# Altium schematic sheet ACPowerDistributionUSB-PD.SchDoc
size A3; SheetNumber: 4; SheetTotal: 5
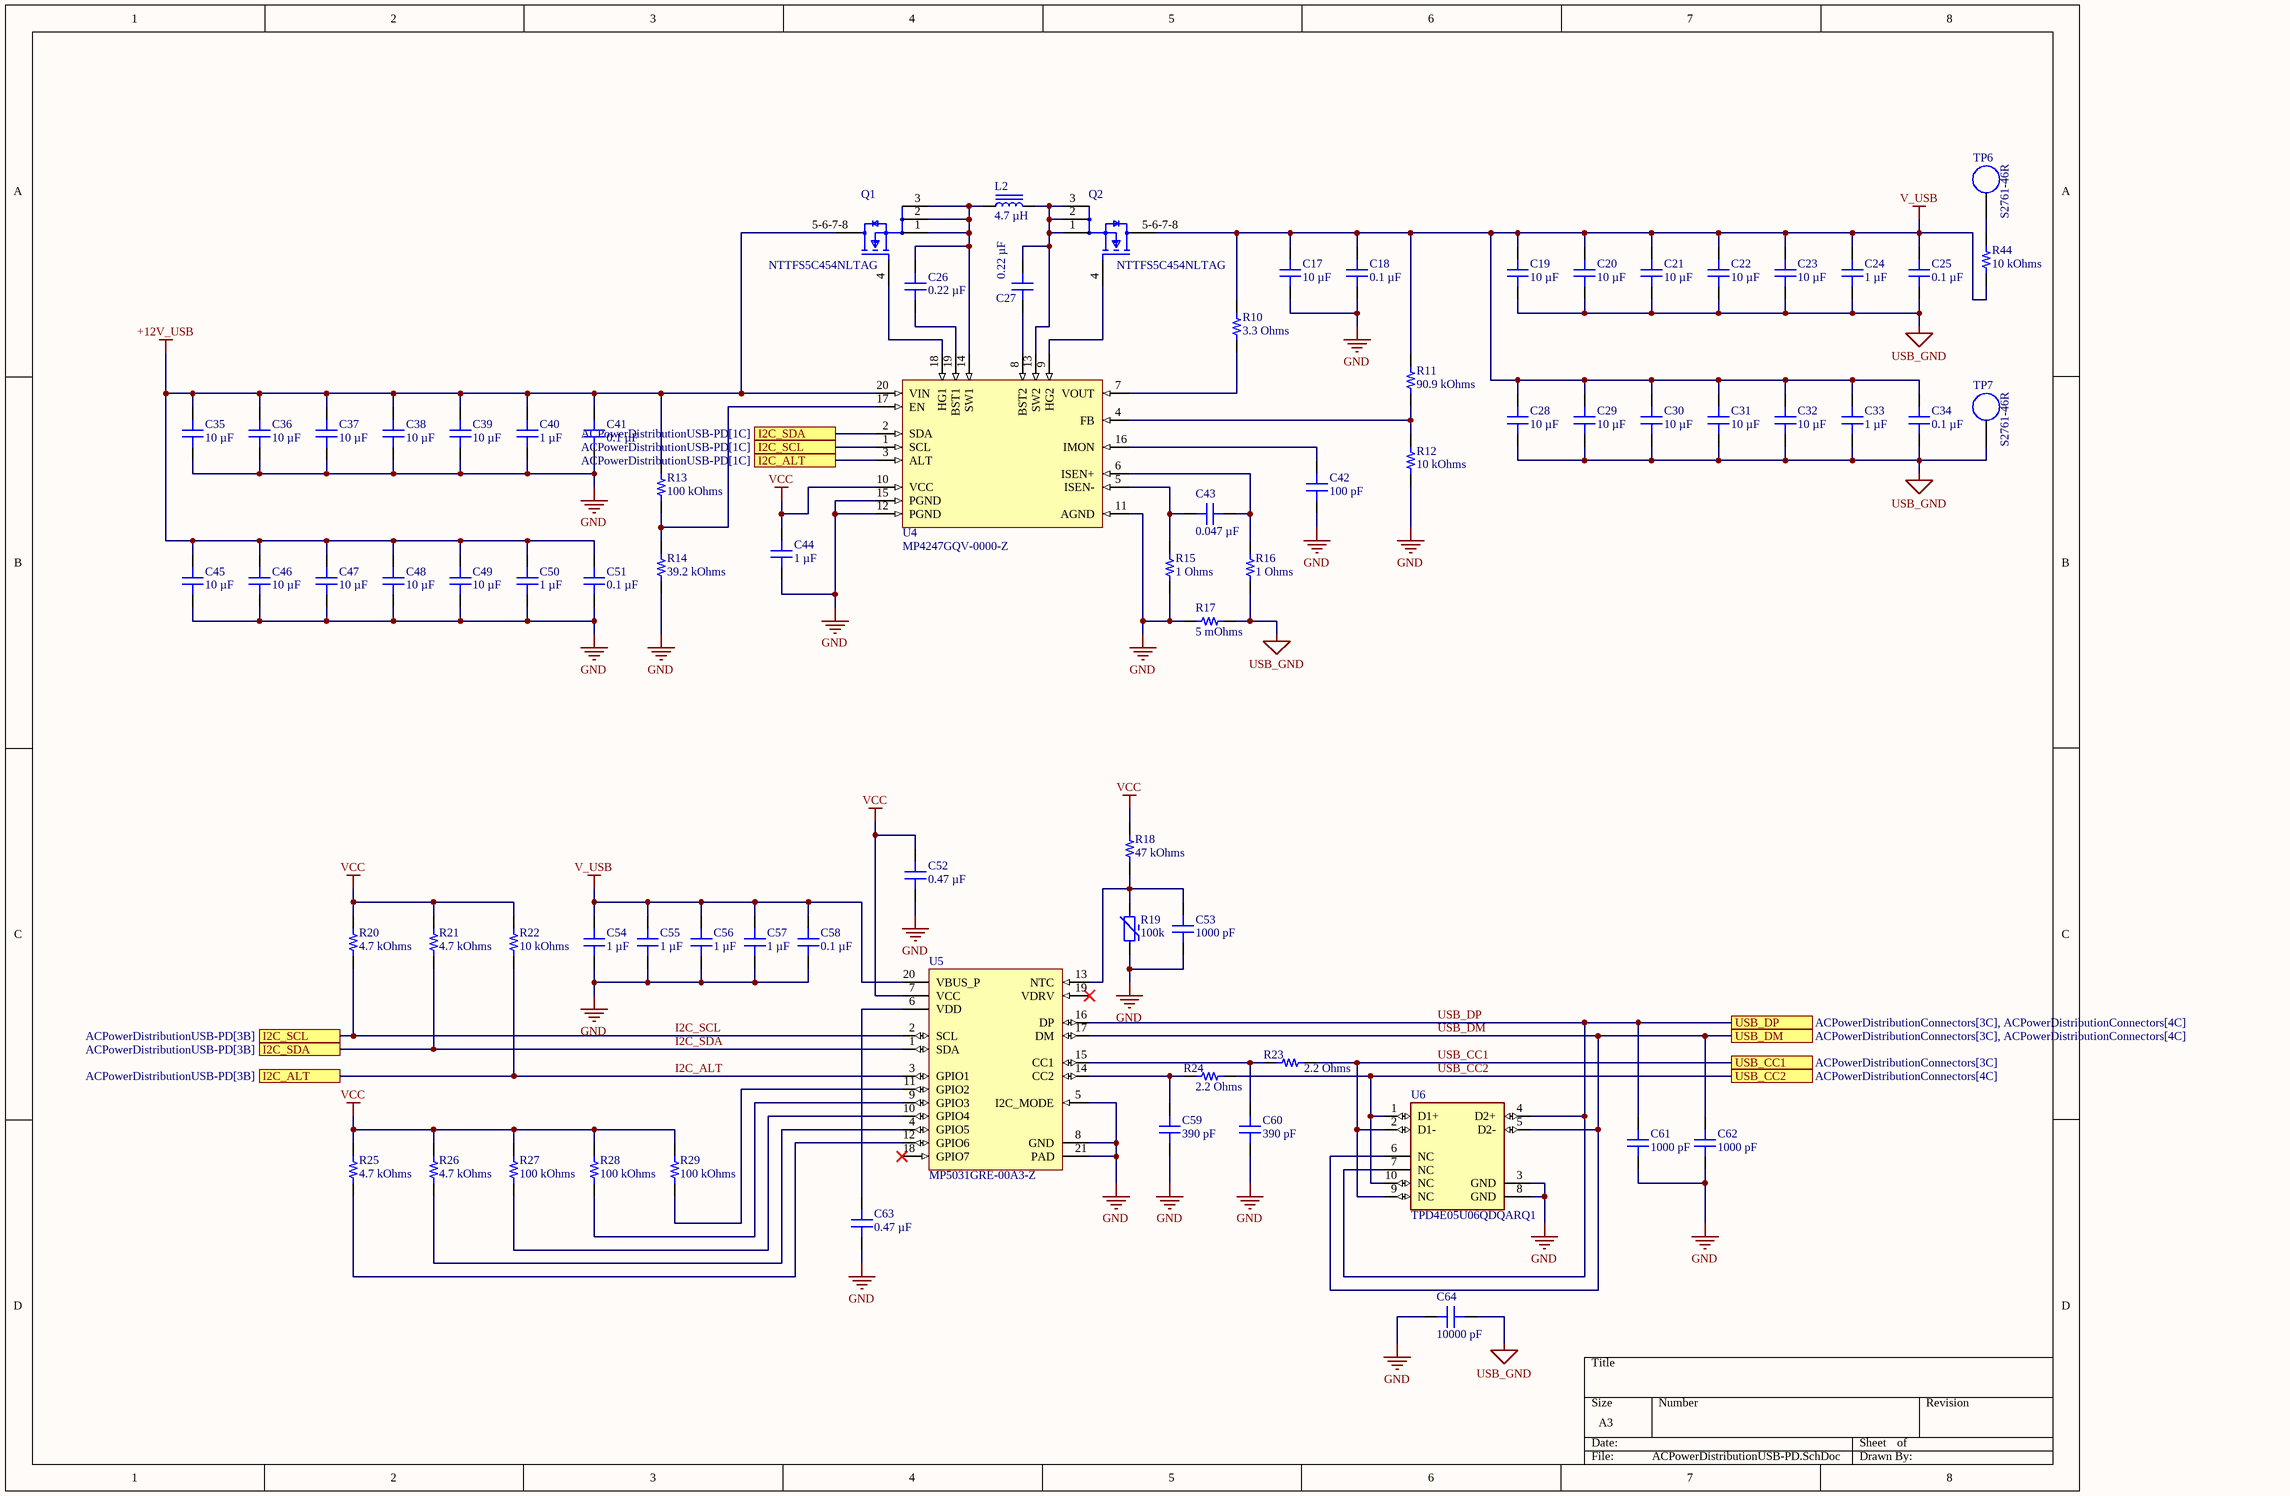
[diagram p0: ACPowerDistributionUSB-PD.SchDoc]

## Parts
C17  10 µF  [CAP 1210_3225 - 1MM]
C18  0.1 µF  [CAP 0603_1608]
C19  10 µF  [CAP 1210_3225 - 1MM]
C20  10 µF  [CAP 1210_3225 - 1MM]
C21  10 µF  [CAP 1210_3225 - 1MM]
C22  10 µF  [CAP 1210_3225 - 1MM]
C23  10 µF  [CAP 1210_3225 - 1MM]
C24  1 µF  [CAP 0603_1608]
C25  0.1 µF  [CAP 0603_1608]
C26  0.22 µF  [MURATA GRM188 0603_1608]
C27  0.22 µF  [MURATA GRM188 0603_1608]
C28  10 µF  [CAP 1210_3225 - 1MM]
C29  10 µF  [CAP 1210_3225 - 1MM]
C30  10 µF  [CAP 1210_3225 - 1MM]
C31  10 µF  [CAP 1210_3225 - 1MM]
C32  10 µF  [CAP 1210_3225 - 1MM]
C33  1 µF  [CAP 0603_1608]
C34  0.1 µF  [CAP 0603_1608]
C35  10 µF  [CAP 1210_3225 - 1MM]
C36  10 µF  [CAP 1210_3225 - 1MM]
C37  10 µF  [CAP 1210_3225 - 1MM]
C38  10 µF  [CAP 1210_3225 - 1MM]
C39  10 µF  [CAP 1210_3225 - 1MM]
C40  1 µF  [CAP 0603_1608]
C41  0.1 µF  [CAP 0603_1608]
C42  100 pF  [CAP 0603_1608]
C43  0.047 µF  [CAP 0603_1608]
C44  1 µF  [CAP 0603_1608]
C45  10 µF  [CAP 1210_3225 - 1MM]
C46  10 µF  [CAP 1210_3225 - 1MM]
C47  10 µF  [CAP 1210_3225 - 1MM]
C48  10 µF  [CAP 1210_3225 - 1MM]
C49  10 µF  [CAP 1210_3225 - 1MM]
C50  1 µF  [CAP 0603_1608]
C51  0.1 µF  [CAP 0603_1608]
C52  0.47 µF  [CAP 0603_1608]
C53  1000 pF  [CAP 0603_1608]
C54  1 µF  [CAP 0603_1608]
C55  1 µF  [CAP 0603_1608]
C56  1 µF  [CAP 0603_1608]
C57  1 µF  [CAP 0603_1608]
C58  0.1 µF  [CAP 0603_1608]
C59  390 pF  [CAP 0603_1608]
C60  390 pF  [CAP 0603_1608]
C61  1000 pF  [CAP 0603_1608]
C62  1000 pF  [CAP 0603_1608]
C63  0.47 µF  [CAP 0603_1608]
C64  10000 pF  [CAP 0603_1608]
L2  4.7 µH  [WURTH WE-HCI 7040]
Q1  NTTFS5C454NLTAG  [FP-511AB-MFG]
Q2  NTTFS5C454NLTAG  [FP-511AB-MFG]
R10  3.3 Ohms  [RES 0603_1608]
R11  90.9 kOhms  [RES 0603_1608]
R12  10 kOhms  [RES 0603_1608]
R13  100 kOhms  [RES 0603_1608]
R14  39.2 kOhms  [RES 0603_1608]
R15  1 Ohms  [RES 0603_1608]
R16  1 Ohms  [RES 0603_1608]
R17  5 mOhms  [STACKPOLE CSR1206]
R18  47 kOhms  [RES 0603_1608]
R19  100k  [NTC 0603_1608]
R20  4.7 kOhms  [RES 0603_1608]
R21  4.7 kOhms  [RES 0603_1608]
R22  10 kOhms  [RES 0603_1608]
R23  2.2 Ohms  [RES 0603_1608]
R24  2.2 Ohms  [RES 0603_1608]
R25  4.7 kOhms  [RES 0603_1608]
R26  4.7 kOhms  [RES 0603_1608]
R27  100 kOhms  [RES 0603_1608]
R28  100 kOhms  [RES 0603_1608]
R29  100 kOhms  [RES 0603_1608]
R44  10 kOhms  [RES 0603_1608]
TP6  S2761-46R  [S2761-46R]
TP7  S2761-46R  [S2761-46R]
U4  MP4247GQV-0000-Z  [MP4247GQV]
U5  MP5031GRE-00A3-Z  [MP5031GRE]
U6  TPD4E05U06QDQARQ1  [FP-DQA0010A-MFG]

## Ports
I2C_ALT (see ACPowerDistributionUSB-PD[1C]), I2C_ALT (see ACPowerDistributionUSB-PD[3B]), I2C_SCL (see ACPowerDistributionUSB-PD[1C]), I2C_SCL (see ACPowerDistributionUSB-PD[3B]), I2C_SDA (see ACPowerDistributionUSB-PD[1C]), I2C_SDA (see ACPowerDistributionUSB-PD[3B]), USB_CC1 (see ACPowerDistributionConnectors[3C]), USB_CC2 (see ACPowerDistributionConnectors[4C]), USB_DM (see ACPowerDistributionConnectors[3C], ACPowerDistributionConnectors[4C]), USB_DP (see ACPowerDistributionConnectors[3C], ACPowerDistributionConnectors[4C])

## Nets
+12V_USB: C35.2 C36.2 C37.2 C38.2 C39.2 C40.2 C41.2 C45.2 C46.2 C47.2 C48.2 C49.2 C50.2 C51.2 Q1.5-6-7-8(D) R13.2 U4.20(VIN)
GND: C17.1 C18.1 C35.1 C36.1 C37.1 C38.1 C39.1 C40.1 C41.1 C42.1 C44.1 C45.1 C46.1 C47.1 C48.1 C49.1 C50.1 C51.1 C52.1 C53.1 C54.1 C55.1 C56.1 C57.1 C58.1 C59.1 C60.1 C61.1 C62.1 C63.1 C64.1 R12.1 R14.1 R15.1 R17.1 R19.1 U4.11(AGND) U4.12(PGND) U4.15(PGND) U5.5(I2C_MODE) U5.8(GND) U5.21(PAD) U6.3(GND) U6.8(GND)
USB_GND: C19.1 C20.1 C21.1 C22.1 C23.1 C24.1 C25.1 C28.1 C29.1 C30.1 C31.1 C32.1 C33.1 C34.1 C64.2 R16.1 R17.2 TP7.1
V_USB: C17.2 C18.2 C19.2 C20.2 C21.2 C22.2 C23.2 C24.2 C25.2 C28.2 C29.2 C30.2 C31.2 C32.2 C33.2 C34.2 C54.2 C55.2 C56.2 C57.2 C58.2 Q2.5-6-7-8(D) R10.2 R11.2 R44.1 U5.20(VBUS_P)
VCC: C44.2 C52.2 R18.2 R20.2 R21.2 R22.2 R25.2 R26.2 R27.2 R28.2 R29.2 U4.10(VCC) U5.7(VCC)
I2C_ALT: R22.1 U4.3(ALT) U5.3(GPIO1) ; port I2C_ALT
I2C_SCL: R20.1 U4.1(SCL) U5.2(SCL) ; port I2C_SCL
I2C_SDA: R21.1 U4.2(SDA) U5.1(SDA) ; port I2C_SDA
USB_CC1: R23.2 U6.2(D1-) U6.9(NC) ; port USB_CC1
USB_CC2: R24.2 U6.1(D1+) U6.10(NC) ; port USB_CC2
USB_DM: C62.2 U5.17(DM) U6.5(D2-) U6.6(NC) ; port USB_DM
USB_DP: C61.2 U5.16(DP) U6.4(D2+) U6.7(NC) ; port USB_DP
NetC26_1: C26.1 U4.19(BST1)
NetC26_2: C26.2 L2.1 Q1.1(S) Q1.2(S) Q1.3(S) U4.14(SW1)
NetC27_1: C27.1 U4.8(BST2)
NetC27_2: C27.2 L2.2 Q2.1(S) Q2.2(S) Q2.3(S) U4.13(SW2)
NetC42_2: C42.2 U4.16(IMON)
NetC43_1: C43.1 R15.2 U4.5(ISEN-)
NetC43_2: C43.2 R16.2 U4.6(ISEN+)
NetC53_2: C53.2 R18.1 R19.2 U5.13(NTC)
NetC59_2: C59.2 R24.1 U5.14(CC2)
NetC60_2: C60.2 R23.1 U5.15(CC1)
NetC63_2: C63.2 U5.6(VDD)
NetQ1_4: Q1.4(G) U4.18(HG1)
NetQ2_4: Q2.4(G) U4.9(HG2)
NetR10_1: R10.1 U4.7(VOUT)
NetR11_1: R11.1 R12.2 U4.4(FB)
NetR13_1: R13.1 R14.2 U4.17(EN)
NetR25_1: R25.1 U5.12(GPIO6)
NetR26_1: R26.1 U5.4(GPIO5)
NetR27_1: R27.1 U5.10(GPIO4)
NetR28_1: R28.1 U5.9(GPIO3)
NetR29_1: R29.1 U5.11(GPIO2)
NetR44_2: R44.2 TP6.1

Not connected (* = marked no-connect by the designer): U5 18(GPIO7)* 19(VDRV)*

## Library data of the parts
C17 C19-C23 C28-C32 C35-C39 C45-C49 = GCM32EC71H106KA03L: CAP CER 10UF 50V X7S 1210; manufacturer: Murata Electronics; Tolerance: ±10%; Part Number: GCM32EC71H106KA03L; Value: 10 µF; Applications: Automotive; Capacitance: 10 µF; componentlink1description: Datasheet; componentlink1url: https://search.murata.co.jp/Ceramy/image/img/A01X/G101/ENG/GCM32EC71H106KA03-01.pdf; componentlink2description: DigiKey Link; componentlink2url: https://www.digikey.com/en/products/detail/murata-electronics/GCM32EC71H106KA03L/4903991; Device Package: 1210 (3225 Metric); lastupdated: 6/4/2024 7:21:03 PM; Lifecycle Status: Active; Minimum Order: 1; Mounting Type: Surface Mount, MLCC; Operating Temperature: -55°C ~ 125°C; Package / Case: 1210 (3225 Metric); packaging: TapeAndReel; partid: 23812; Part Status: Active; price: 0.25; Ratings: AEC-Q200; series: GCM; Size / Dimension: 0.126" L x 0.098" W (3.20mm x 2.50mm); Supplier 1: DigiKey; Supplier Part Number 1: 490-14536-1-ND; Temperature Coefficient: X7S; Thickness (Max): 0.106" (2.70mm); Voltage - Rated: 50V
C18 C25 C34 C41 C51 C58 = CL10B104KA8WPNC: CAP CER 0.1UF 25V X7R 0603; manufacturer: Samsung Electro-Mechanics; Tolerance: ±10%; Part Number: CL10B104KA8WPNC; Capacitance: 0.1 µF; Applications: Automotive; componentlink1description: Datasheet; componentlink1url: http://www.samsungsem.com/kr/support/product-search/mlcc/CL10B104KA8WPNC.jsp; componentlink2description: DigiKey Link; componentlink2url: https://www.digikey.com/en/products/detail/samsung-electro-mechanics/CL10B104KA8WPNC/5961201; Device Package: 0603 (1608 Metric); Features: Open Mode; lastupdated: 2/9/2024 8:10:26 PM; Lifecycle Status: Active; Minimum Order: 1; Mounting Type: Surface Mount, MLCC; Operating Temperature: -55°C ~ 125°C; Package / Case: 0603 (1608 Metric); packaging: TapeAndReel; partid: 5631; Part Status: Active; price: 0.01; Ratings: AEC-Q200; series: CL; Size / Dimension: 0.063" L x 0.031" W (1.60mm x 0.80mm); Supplier 1: DigiKey; Supplier Part Number 1: 1276-6717-1-ND; Temperature Coefficient: X7R; Thickness (Max): 0.035" (0.90mm); value: 0.1 µF; Voltage - Rated: 25V
C24 C33 C40 C44 C50 C54-C57 = CL10A105KA8NNNC: CAP CER 1UF 25V X5R 0603; manufacturer: Samsung Electro-Mechanics; Tolerance: ±10%; Part Number: CL10A105KA8NNNC; Capacitance: 1 µF; Applications: General Purpose; componentlink1description: Datasheet; componentlink1url: http://www.samsungsem.com/kr/support/product-search/mlcc/CL10A105KA8NNNC.jsp; componentlink2description: DigiKey Link; componentlink2url: https://www.digikey.com/en/products/detail/samsung-electro-mechanics/CL10A105KA8NNNC/3886760; Device Package: 0603 (1608 Metric); lastupdated: 2/9/2024 8:10:26 PM; Lifecycle Status: Active; Minimum Order: 1; Mounting Type: Surface Mount, MLCC; Operating Temperature: -55°C ~ 85°C; Package / Case: 0603 (1608 Metric); packaging: TapeAndReel; partid: 5508; Part Status: Active; price: 0.01; series: CL; Size / Dimension: 0.063" L x 0.031" W (1.60mm x 0.80mm); Supplier 1: DigiKey; Supplier Part Number 1: 1276-1102-1-ND; Temperature Coefficient: X5R; Thickness (Max): 0.035" (0.90mm); value: 1 µF; Voltage - Rated: 25V
C26 C27 = GRM188R71H224KAC4D: CAP CER 0.22UF 50V X7R 0603; manufacturer: Murata Electronics; Tolerance: ±10%; Part Number: GRM188R71H224KAC4D; Capacitance: 0.22 µF; Applications: General Purpose; componentlink1description: Datasheet; componentlink1url: https://search.murata.co.jp/Ceramy/image/img/A01X/G101/ENG/GRM188R71H224KAC4-01.pdf; componentlink2description: DigiKey Link; componentlink2url: https://www.digikey.com/en/products/detail/murata-electronics/GRM188R71H224KAC4D/5797498; Device Package: 0603 (1608 Metric); lastupdated: 7/20/2024 12:23:21 AM; Lifecycle Status: Active; Minimum Order: 1; Mounting Type: Surface Mount, MLCC; Operating Temperature: -55°C ~ 125°C; Package / Case: 0603 (1608 Metric); packaging: TapeAndReel; partid: 8415; Part Status: Active; price: 0.02; series: GRM; Size / Dimension: 0.063" L x 0.031" W (1.60mm x 0.80mm); Supplier 1: DigiKey; Supplier Part Number 1: 490-12546-1-ND; Temperature Coefficient: X7R; Thickness (Max): 0.035" (0.90mm); value: 0.22 µF; Voltage - Rated: 50V
C42 = CC0603JRNPO8BN101: CAP CER 100PF 25V C0G/NPO 0603; manufacturer: Yageo; Temperature Coefficient: C0G, NP0; Tolerance: ±5%; Part Number: CC0603JRNPO8BN101; Capacitance: 100 pF; Applications: General Purpose; componentlink1description: Datasheet; componentlink1url: https://www.yageo.com/upload/media/product/productsearch/datasheet/mlcc/UPY-GP_NP0_16V-to-50V_17.pdf; componentlink2description: DigiKey Link; componentlink2url: https://www.digikey.com/en/products/detail/yageo/CC0603JRNPO8BN101/5883587; Device Package: 0603 (1608 Metric); lastupdated: 2/9/2024 8:10:21 PM; Lifecycle Status: Active; Minimum Order: 1; Mounting Type: Surface Mount, MLCC; Operating Temperature: -55°C ~ 125°C; Package / Case: 0603 (1608 Metric); packaging: TapeAndReel; partid: 9439; Part Status: Active; price: 0.01; series: CC; Size / Dimension: 0.063" L x 0.031" W (1.60mm x 0.80mm); Supplier 1: DigiKey; Supplier Part Number 1: 311-3949-1-ND; Thickness (Max): 0.035" (0.90mm); value: 100 pF; Voltage - Rated: 25V
C43 = CL10B473KB8NNNC: CAP CER 0.047UF 50V X7R 0603; manufacturer: Samsung Electro-Mechanics; Tolerance: ±10%; Part Number: CL10B473KB8NNNC; Capacitance: 0.047 µF; Applications: General Purpose; componentlink1description: Datasheet; componentlink1url: http://www.samsungsem.com/kr/support/product-search/mlcc/CL10B473KB8NNNC.jsp; componentlink2description: DigiKey Link; componentlink2url: https://www.digikey.com/en/products/detail/samsung-electro-mechanics/CL10B473KB8NNNC/3886721; Device Package: 0603 (1608 Metric); lastupdated: 2/9/2024 8:10:20 PM; Lifecycle Status: Active; Minimum Order: 1; Mounting Type: Surface Mount, MLCC; Operating Temperature: -55°C ~ 125°C; Package / Case: 0603 (1608 Metric); packaging: TapeAndReel; partid: 9888; Part Status: Active; price: 0.01; series: CL; Size / Dimension: 0.063" L x 0.031" W (1.60mm x 0.80mm); Supplier 1: DigiKey; Supplier Part Number 1: 1276-1063-1-ND; Temperature Coefficient: X7R; Thickness (Max): 0.035" (0.90mm); value: 0.047 µF; Voltage - Rated: 50V
C52 C63 = CC0603KRX5R8BB474: CAP CER 0.47UF 25V X5R 0603; manufacturer: Yageo; Tolerance: ±10%; Part Number: CC0603KRX5R8BB474; Capacitance: 0.47 µF; Applications: General Purpose; componentlink1description: Datasheet; componentlink1url: https://www.yageo.com/upload/media/product/productsearch/datasheet/mlcc/UPY-GPHC_X5R_4V-to-50V_25.pdf; componentlink2description: DigiKey Link; componentlink2url: https://www.digikey.com/en/products/detail/yageo/CC0603KRX5R8BB474/5883728; Device Package: 0603 (1608 Metric); lastupdated: 2/9/2024 8:10:30 PM; Lifecycle Status: Active; Minimum Order: 1; Mounting Type: Surface Mount, MLCC; Operating Temperature: -55°C ~ 85°C; Package / Case: 0603 (1608 Metric); packaging: TapeAndReel; partid: 2276; Part Status: Active; price: 0.01; series: CC; Size / Dimension: 0.063" L x 0.031" W (1.60mm x 0.80mm); Supplier 1: DigiKey; Supplier Part Number 1: 311-3365-1-ND; Temperature Coefficient: X5R; Thickness (Max): 0.035" (0.90mm); value: 0.47 µF; Voltage - Rated: 25V
C53 = CC0603JRNPO7BN102: CAP CER 1000PF 16V C0G/NPO 0603; manufacturer: Yageo; Temperature Coefficient: C0G, NP0; Tolerance: ±5%; Part Number: CC0603JRNPO7BN102; Capacitance: 1000 pF; Applications: General Purpose; componentlink1description: Datasheet; componentlink1url: https://www.yageo.com/upload/media/product/productsearch/datasheet/mlcc/UPY-GP_NP0_16V-to-50V_17.pdf; componentlink2description: DigiKey Link; componentlink2url: https://www.digikey.com/en/products/detail/yageo/CC0603JRNPO7BN102/5883578; Device Package: 0603 (1608 Metric); lastupdated: 2/9/2024 8:10:21 PM; Lifecycle Status: Active; Minimum Order: 1; Mounting Type: Surface Mount, MLCC; Operating Temperature: -55°C ~ 125°C; Package / Case: 0603 (1608 Metric); packaging: TapeAndReel; partid: 9184; Part Status: Active; price: 0.01; series: CC; Size / Dimension: 0.063" L x 0.031" W (1.60mm x 0.80mm); Supplier 1: DigiKey; Supplier Part Number 1: 311-3947-1-ND; Thickness (Max): 0.035" (0.90mm); value: 1000 pF; Voltage - Rated: 16V
C59 C60 = CC0603KRX7R9BB391: CAP CER 390PF 50V X7R 0603; manufacturer: Yageo; Tolerance: ±10%; Part Number: CC0603KRX7R9BB391; Capacitance: 390 pF; Applications: General Purpose; componentlink1description: Datasheet; componentlink1url: https://www.yageo.com/upload/media/product/productsearch/datasheet/mlcc/UPY-GPHC_X7R_6.3V-to-50V_18.pdf; componentlink2description: DigiKey Link; componentlink2url: https://www.digikey.com/en/products/detail/yageo/CC0603KRX7R9BB391/372860; Device Package: 0603 (1608 Metric); lastupdated: 2/9/2024 8:10:09 PM; Lifecycle Status: Active; Minimum Order: 1; Mounting Type: Surface Mount, MLCC; Operating Temperature: -55°C ~ 125°C; Package / Case: 0603 (1608 Metric); packaging: TapeAndReel; partid: 16742; Part Status: Active; price: 0.01; series: CC; Size / Dimension: 0.063" L x 0.031" W (1.60mm x 0.80mm); Supplier 1: DigiKey; Supplier Part Number 1: 311-1187-1-ND; Temperature Coefficient: X7R; Thickness (Max): 0.035" (0.90mm); value: 390 pF; Voltage - Rated: 50V
C61 C62 = C1608X8R1H102K080AA: CAP CER 1000PF 50V X8R 0603; manufacturer: TDK Corporation; Tolerance: ±10%; Part Number: C1608X8R1H102K080AA; Capacitance: 1000 pF; Applications: General Purpose; componentlink1description: Datasheet; componentlink1url: https://product.tdk.com/info/en/catalog/datasheets/mlcc_commercial_hightemp_en.pdf?ref_disty=digikey; componentlink2description: DigiKey Link; componentlink2url: https://www.digikey.com/en/products/detail/tdk-corporation/C1608X8R1H102K080AA/927127; Device Package: 0603 (1608 Metric); Features: High Temperature; lastupdated: 2/9/2024 8:10:30 PM; Lifecycle Status: Active; Minimum Order: 1; Mounting Type: Surface Mount, MLCC; Operating Temperature: -55°C ~ 150°C; Package / Case: 0603 (1608 Metric); packaging: TapeAndReel; partid: 2708; Part Status: Active; price: 0.01; series: C; Size / Dimension: 0.063" L x 0.031" W (1.60mm x 0.80mm); Supplier 1: DigiKey; Supplier Part Number 1: 445-2501-1-ND; Temperature Coefficient: X8R; Thickness (Max): 0.035" (0.90mm); value: 1000 pF; Voltage - Rated: 50V
C64 = CGA3E2X8R1H103K080AA: CAP CER 10000PF 50V X8R 0603; manufacturer: TDK Corporation; Tolerance: ±10%; Part Number: CGA3E2X8R1H103K080AA; Capacitance: 10000 pF; Applications: Automotive; componentlink1description: Datasheet; componentlink1url: https://product.tdk.com/info/en/catalog/datasheets/mlcc_automotive_hightemp_en.pdf?ref_disty=digikey; componentlink2description: DigiKey Link; componentlink2url: https://www.digikey.com/en/products/detail/tdk-corporation/CGA3E2X8R1H103K080AA/2443370; Device Package: 0603 (1608 Metric); Features: High Temperature; lastupdated: 2/9/2024 8:10:29 PM; Lifecycle Status: Active; Minimum Order: 1; Mounting Type: Surface Mount, MLCC; Operating Temperature: -55°C ~ 150°C; Package / Case: 0603 (1608 Metric); packaging: TapeAndReel; partid: 2732; Part Status: Active; price: 0.01; Ratings: AEC-Q200; series: CGA; Size / Dimension: 0.063" L x 0.031" W (1.60mm x 0.80mm); Supplier 1: DigiKey; Supplier Part Number 1: 445-5892-1-ND; Temperature Coefficient: X8R; Thickness (Max): 0.035" (0.90mm); value: 10000 pF; Voltage - Rated: 50V
L2 = 744311470: FIXED IND 4.7UH 6A 19.5 MOHM SMD; Manufacturer: Würth Elektronik; Current - Saturation: 7A; Frequency - Self Resonant: 33MHz; Inductance Frequency - Test: 100 kHz; Material - Core: Nonstandard; Shielding: Shielded; Tolerance: ±20%; Type: Wirewound; Part Number: 744311470; ComponentLink1Description: Datasheet; ComponentLink1URL: https://katalog.we-online.de/pbs/datasheet/744311470.pdf; ComponentLink2Description: DigiKey Link; ComponentLink2URL: https://www.digikey.com/en/products/detail/würth-elektronik/744311470/1638558; Current Rating (Amps): 6 A; DC Resistance (DCR): 19.5mOhm; Device Package: Nonstandard; Height - Seated (Max): 0.157" (4.00mm); Inductance: 4.7 µH; LastUpdated: 6/3/2024 8:02:48 PM; Lifecycle Status: Active; Minimum Order: 1; Mounting Type: Surface Mount; Operating Temperature: -40°C ~ 150°C; Package / Case: Nonstandard; Packaging: TapeAndReel; PartId: 258; Part Status: Active; Price: 2.72; Ratings: AEC-Q200; Series: WE-HCI; Size / Dimension: 0.276" L x 0.272" W (7.00mm x 6.90mm); Supplier 1: DigiKey; Supplier Part Number 1: 732-1153-1-ND; Supplier Device Package: 7040; Value: 4.7 µH
Q1 Q2 = CMP-00278-71475164-1: NTTFS5C454NLTAG Single N-Channel Power MOSFET 40V, 85A, 3.8mΩ Power MOSFET 40V, 85A, 3.8 mOhm, Single N-Channel, u8FL, Logic Level; Manufacturer Lifecycle Status: ACTIVE; Max Power Dissipation: 3.2W; Turn-On Delay Time: 9.3ns; Turn-Off Delay Time: 17ns; Gate to Source Voltage (Vgs): 20V; Continuous Drain Current (ID): 20A; Drain to Source Resistance: 4.8mΩ; Max Junction Temperature (Tj): 175°C; Input Capacitance: 1.6nF; Number of Channels: 1; Threshold Voltage: 2V; Lead Free: Lead Free; Drain to Source Voltage (Vdss): 40V; Schedule B: 8541290080; Number of Pins: 8; Mount: Surface Mount; Power Dissipation: 3.2W; Min Operating Temperature: -55°C; RoHS: Compliant; Drain to Source Breakdown Voltage: 40V; Max Operating Temperature: 175°C; Height: 800µm; Lifecycle Status: Production; NexarPartId: 71475164; REACH SVHC: No SVHC; Rds On Max: 3.8mΩ
R10 = RMCF0603FT3R30: RES 3.3 OHM 1% 1/10W 0603; Manufacturer: Stackpole Electronics Inc; Power (Watts): 0.1W, 1/10W; Temperature Coefficient: ±200ppm/°C; Part Number: RMCF0603FT3R30; Value: 3.3 Ohms; ComponentLink1Description: Datasheet; ComponentLink1URL: https://www.seielect.com/catalog/sei-rmcf_rmcp.pdf; ComponentLink2Description: DigiKey Link; ComponentLink2URL: https://www.digikey.com/en/products/detail/stackpole-electronics-inc/RMCF0603FT3R30/4440027; Composition: Thick Film; Device Package: 0603 (1608 Metric); Features: Automotive AEC-Q200; Height - Seated (Max): 0.022" (0.55mm); LastUpdated: 2/9/2024 8:42:27 PM; Lifecycle Status: Active; Minimum Order: 1; Number of Terminations: 2; Operating Temperature: -55°C ~ 155°C; Package / Case: 0603 (1608 Metric); Packaging: CutTape; PartId: 22571; Part Status: Active; Price: 0.01; Ratings: AEC-Q200; Resistance: 3.3 Ohms; Series: RMCF; Size / Dimension: 0.061" L x 0.031" W (1.55mm x 0.80mm); Supplier 1: DigiKey; Supplier Part Number 1: RMCF0603FT3R30CT-ND; Supplier Device Package: 0603; Tolerance: ±1%
R11 = RMCF0603FT90K9: RES 90.9K OHM 1% 1/10W 0603; Manufacturer: Stackpole Electronics Inc; Power (Watts): 0.1W, 1/10W; Temperature Coefficient: ±100ppm/°C; Part Number: RMCF0603FT90K9; Value: 90.9 kOhms; ComponentLink1Description: Datasheet; ComponentLink1URL: https://www.seielect.com/catalog/sei-rmcf_rmcp.pdf; ComponentLink2Description: DigiKey Link; ComponentLink2URL: https://www.digikey.com/en/products/detail/stackpole-electronics-inc/RMCF0603FT90K9/1760931; Composition: Thick Film; Device Package: 0603 (1608 Metric); Features: Automotive AEC-Q200; Height - Seated (Max): 0.022" (0.55mm); LastUpdated: 2/9/2024 8:43:13 PM; Lifecycle Status: Active; Minimum Order: 1; Number of Terminations: 2; Operating Temperature: -55°C ~ 155°C; Package / Case: 0603 (1608 Metric); Packaging: CutTape; PartId: 10780; Part Status: Active; Price: 0.01; Ratings: AEC-Q200; Resistance: 90.9 kOhms; Series: RMCF; Size / Dimension: 0.061" L x 0.031" W (1.55mm x 0.80mm); Supplier 1: DigiKey; Supplier Part Number 1: RMCF0603FT90K9CT-ND; Supplier Device Package: 0603; Tolerance: ±1%
R12 R22 R44 = RMCF0603FT10K0: RES 10K OHM 1% 1/10W 0603; Manufacturer: Stackpole Electronics Inc; Power (Watts): 0.1W, 1/10W; Temperature Coefficient: ±100ppm/°C; Part Number: RMCF0603FT10K0; Value: 10 kOhms; ComponentLink1Description: Datasheet; ComponentLink1URL: https://www.seielect.com/catalog/sei-rmcf_rmcp.pdf; ComponentLink2Description: DigiKey Link; ComponentLink2URL: https://www.digikey.com/en/products/detail/stackpole-electronics-inc/RMCF0603FT10K0/1761235; Composition: Thick Film; Device Package: 0603 (1608 Metric); Features: Automotive AEC-Q200; Height - Seated (Max): 0.022" (0.55mm); LastUpdated: 2/9/2024 8:42:00 PM; Lifecycle Status: Active; Minimum Order: 1; Number of Terminations: 2; Operating Temperature: -55°C ~ 155°C; Package / Case: 0603 (1608 Metric); Packaging: CutTape; PartId: 25663; Part Status: Active; Price: 0.01; Ratings: AEC-Q200; Resistance: 10 kOhms; Series: RMCF; Size / Dimension: 0.061" L x 0.031" W (1.55mm x 0.80mm); Supplier 1: DigiKey; Supplier Part Number 1: RMCF0603FT10K0CT-ND; Supplier Device Package: 0603; Tolerance: ±1%
R13 R27-R29 = RMCF0603FT100K: RES 100K OHM 1% 1/10W 0603; Manufacturer: Stackpole Electronics Inc; Power (Watts): 0.1W, 1/10W; Temperature Coefficient: ±100ppm/°C; Part Number: RMCF0603FT100K; Value: 100 kOhms; ComponentLink1Description: Datasheet; ComponentLink1URL: https://www.seielect.com/catalog/sei-packaging.pdf; ComponentLink2Description: DigiKey Link; ComponentLink2URL: https://www.digikey.com/en/products/detail/stackpole-electronics-inc/RMCF0603FT100K/1761112; Composition: Thick Film; Device Package: 0603 (1608 Metric); Features: Automotive AEC-Q200; Height - Seated (Max): 0.022" (0.55mm); LastUpdated: 2/9/2024 8:42:00 PM; Lifecycle Status: Active; Minimum Order: 1; Number of Terminations: 2; Operating Temperature: -55°C ~ 155°C; Package / Case: 0603 (1608 Metric); Packaging: CutTape; PartId: 25664; Part Status: Active; Price: 0.01; Ratings: AEC-Q200; Resistance: 100 kOhms; Series: RMCF; Size / Dimension: 0.061" L x 0.031" W (1.55mm x 0.80mm); Supplier 1: DigiKey; Supplier Part Number 1: RMCF0603FT100KCT-ND; Supplier Device Package: 0603; Tolerance: ±1%
R14 = RMCF0603FT39K2: RES 39.2K OHM 1% 1/10W 0603; Manufacturer: Stackpole Electronics Inc; Power (Watts): 0.1W, 1/10W; Temperature Coefficient: ±100ppm/°C; Part Number: RMCF0603FT39K2; Value: 39.2 kOhms; ComponentLink1Description: Datasheet; ComponentLink1URL: https://www.seielect.com/catalog/sei-rmcf_rmcp.pdf; ComponentLink2Description: DigiKey Link; ComponentLink2URL: https://www.digikey.com/en/products/detail/stackpole-electronics-inc/RMCF0603FT39K2/1760808; Composition: Thick Film; Device Package: 0603 (1608 Metric); Features: Automotive AEC-Q200; Height - Seated (Max): 0.022" (0.55mm); LastUpdated: 2/9/2024 8:43:13 PM; Lifecycle Status: Active; Minimum Order: 1; Number of Terminations: 2; Operating Temperature: -55°C ~ 155°C; Package / Case: 0603 (1608 Metric); Packaging: CutTape; PartId: 10819; Part Status: Active; Price: 0.01; Ratings: AEC-Q200; Resistance: 39.2 kOhms; Series: RMCF; Size / Dimension: 0.061" L x 0.031" W (1.55mm x 0.80mm); Supplier 1: DigiKey; Supplier Part Number 1: RMCF0603FT39K2CT-ND; Supplier Device Package: 0603; Tolerance: ±1%
R15 R16 = RMCF0603FT1R00: RES 1 OHM 1% 1/10W 0603; Manufacturer: Stackpole Electronics Inc; Power (Watts): 0.1W, 1/10W; Temperature Coefficient: ±200ppm/°C; Part Number: RMCF0603FT1R00; Value: 1 Ohms; ComponentLink1Description: Datasheet; ComponentLink1URL: https://www.seielect.com/catalog/sei-rmcf_rmcp.pdf; ComponentLink2Description: DigiKey Link; ComponentLink2URL: https://www.digikey.com/en/products/detail/stackpole-electronics-inc/RMCF0603FT1R00/1761199; Composition: Thick Film; Device Package: 0603 (1608 Metric); Features: Automotive AEC-Q200; Height - Seated (Max): 0.022" (0.55mm); LastUpdated: 2/9/2024 8:43:31 PM; Lifecycle Status: Active; Minimum Order: 1; Number of Terminations: 2; Operating Temperature: -55°C ~ 155°C; Package / Case: 0603 (1608 Metric); Packaging: CutTape; PartId: 6201; Part Status: Active; Price: 0.01; Ratings: AEC-Q200; Resistance: 1 Ohms; Series: RMCF; Size / Dimension: 0.061" L x 0.031" W (1.55mm x 0.80mm); Supplier 1: DigiKey; Supplier Part Number 1: RMCF0603FT1R00CT-ND; Supplier Device Package: 0603; Tolerance: ±1%
R17 = CFN1206AFX-R005ELF: RES 0.005 OHM 1% 1W 1206; Manufacturer: Bourns Inc.; Temperature Coefficient: ±100ppm/°C; Part Number: CFN1206AFX-R005ELF; Package / Case: 1206 (3216 Metric); ComponentLink1Description: Datasheet; ComponentLink1URL: https://www.bourns.com/docs/product-datasheets/cfn-a.pdf; ComponentLink2Description: DigiKey Link; ComponentLink2URL: https://www.digikey.com/en/products/detail/bourns-inc/CFN1206AFX-R005ELF/14543025; Composition: Metal Foil; Device Package: 1206 (3216 Metric); Features: Automotive AEC-Q200, Current Sense; Height - Seated (Max): 0.028" (0.70mm); LastUpdated: 6/3/2024 7:49:32 PM; Lifecycle Status: Active; Minimum Order: 1; Number of Terminations: 2; Operating Temperature: -55°C ~ 155°C; Packaging: TapeAndReel; PartId: 2845; Part Status: Active; Power (Watts): 1W; Price: 0.08; Ratings: AEC-Q200; Resistance: 5 mOhms; Series: CFN-A; Size / Dimension: 0.126" L x 0.063" W (3.20mm x 1.60mm); Supplier 1: DigiKey; Supplier Part Number 1: 118-CFN1206AFX-R005ELFCT-ND; Supplier Device Package: 1206; Tolerance: ±1%; Value: 5 mOhms
R18 = RMCF0603FT47K0: RES 47K OHM 1% 1/10W 0603; Manufacturer: Stackpole Electronics Inc; Power (Watts): 0.1W, 1/10W; Temperature Coefficient: ±100ppm/°C; Part Number: RMCF0603FT47K0; Value: 47 kOhms; ComponentLink1Description: Datasheet; ComponentLink1URL: https://www.seielect.com/catalog/sei-packaging.pdf; ComponentLink2Description: DigiKey Link; ComponentLink2URL: https://www.digikey.com/en/products/detail/stackpole-electronics-inc/RMCF0603FT47K0/1761148; Composition: Thick Film; Device Package: 0603 (1608 Metric); Features: Automotive AEC-Q200; Height - Seated (Max): 0.022" (0.55mm); LastUpdated: 2/9/2024 8:43:14 PM; Lifecycle Status: Active; Minimum Order: 1; Number of Terminations: 2; Operating Temperature: -55°C ~ 155°C; Package / Case: 0603 (1608 Metric); Packaging: CutTape; PartId: 10590; Part Status: Active; Price: 0.01; Ratings: AEC-Q200; Resistance: 47 kOhms; Series: RMCF; Size / Dimension: 0.061" L x 0.031" W (1.55mm x 0.80mm); Supplier 1: DigiKey; Supplier Part Number 1: RMCF0603FT47K0CT-ND; Supplier Device Package: 0603; Tolerance: ±1%
R19 = B57355V5104F360: THERM NTC 100KOHM 4200K 0603; Manufacturer: EPCOS (TDK); B25/100: 4282K; B25/85: 4260K; B Value Tolerance: ±1%; Power - Max: 180mW; Part Number: B57355V5104F360; B25/50: 4200K; ComponentLink1Description: Datasheet; ComponentLink1URL: https://www.tdk-electronics.tdk.com/inf/50/db/ntc/NTC_SMD_Automotive_series_0603.pdf; ComponentLink2Description: DigiKey Link; ComponentLink2URL: http://digikey.com/product-detail/en/epcos-tdk/B57355V5104F360/495-76084-1-ND/7347815; Device Package: 0603 (1608 Metric); LastUpdated: 6/3/2024 8:04:03 PM; Lifecycle Status: Active; Minimum Order: 1; Mounting Type: Surface Mount; Operating Temperature: -40°C ~ 150°C; Package / Case: 0603 (1608 Metric); Packaging: TapeAndReel; PartId: 351; Part Status: Active; Price: 0.11; Resistance in Ohms @ 25°C: 100k; Resistance Tolerance: ±1%; Series: Automotive, AEC-Q200; Supplier 1: DigiKey; Supplier Part Number 1: 495-76084-1-ND; Value: 100k
R20 R21 R25 R26 = RMCF0603FT4K70: RES 4.7K OHM 1% 1/10W 0603; Manufacturer: Stackpole Electronics Inc; Power (Watts): 0.1W, 1/10W; Temperature Coefficient: ±100ppm/°C; Part Number: RMCF0603FT4K70; Value: 4.7 kOhms; ComponentLink1Description: Datasheet; ComponentLink1URL: https://www.seielect.com/catalog/sei-rmcf_rmcp.pdf; ComponentLink2Description: DigiKey Link; ComponentLink2URL: https://www.digikey.com/en/products/detail/stackpole-electronics-inc/RMCF0603FT4K70/1760998; Composition: Thick Film; Device Package: 0603 (1608 Metric); Features: Automotive AEC-Q200; Height - Seated (Max): 0.022" (0.55mm); LastUpdated: 2/9/2024 8:43:32 PM; Lifecycle Status: Active; Minimum Order: 1; Number of Terminations: 2; Operating Temperature: -55°C ~ 155°C; Package / Case: 0603 (1608 Metric); Packaging: CutTape; PartId: 6078; Part Status: Active; Price: 0.01; Ratings: AEC-Q200; Resistance: 4.7 kOhms; Series: RMCF; Size / Dimension: 0.061" L x 0.031" W (1.55mm x 0.80mm); Supplier 1: DigiKey; Supplier Part Number 1: RMCF0603FT4K70CT-ND; Supplier Device Package: 0603; Tolerance: ±1%
R23 R24 = RMCF0603FT2R20: RES 2.2 OHM 1% 1/10W 0603; Manufacturer: Stackpole Electronics Inc; Power (Watts): 0.1W, 1/10W; Temperature Coefficient: ±200ppm/°C; Part Number: RMCF0603FT2R20; Value: 2.2 Ohms; ComponentLink1Description: Datasheet; ComponentLink1URL: https://www.seielect.com/catalog/sei-rmcf_rmcp.pdf; ComponentLink2Description: DigiKey Link; ComponentLink2URL: https://www.digikey.com/en/products/detail/stackpole-electronics-inc/RMCF0603FT2R20/1713713; Composition: Thick Film; Device Package: 0603 (1608 Metric); Features: Automotive AEC-Q200; Height - Seated (Max): 0.022" (0.55mm); LastUpdated: 2/9/2024 8:41:53 PM; Lifecycle Status: Active; Minimum Order: 1; Number of Terminations: 2; Operating Temperature: -55°C ~ 155°C; Package / Case: 0603 (1608 Metric); Packaging: CutTape; PartId: 26353; Part Status: Active; Price: 0.01; Ratings: AEC-Q200; Resistance: 2.2 Ohms; Series: RMCF; Size / Dimension: 0.061" L x 0.031" W (1.55mm x 0.80mm); Supplier 1: DigiKey; Supplier Part Number 1: RMCF0603FT2R20CT-ND; Supplier Device Package: 0603; Tolerance: ±1%
U6 = CMP-04985-000004-1: TVS DIODE 5.5V 14V 10USON; Manufacturer: Texas Instruments; Direction: Unidirectional; Standoff Height: 0mm; Capacitance: 0.5pF; Number Of Channels: 4; Breakdown Voltage: 6.4V; Peak Pulse Power: 2.5W; Automotive Grade: Grade 1; Value: 0.5pF; Interface: USB,Ethernet,LVDS,Other; Peak Pulse Current: 2.5A; Operating Supply Voltage: 5.5V; Reverse Standoff Voltage: 5.5V; Package: DQA0010A; Temperature Range Low: -40°C; Temperature Range High: +125°C; Ambient Temperature Range Low: -40°C; Device Class L1: Circuit Protection; Clamping Voltage: 14V; Manufacturer Part Number: TPD4E05U06QDQARQ1; Device Class L2: ESD and Circuit Protection ICs; Octopart: https://octopart.com/tpd4e05u06qdqarq1-texas+instruments-48523459; Device Class L3: unset; Height: 0.55mm; Automotive: Yes; ComponentLink2Description: Datasheet; RoHS: TRUE; Ambient Temperature Range High: +125°C; Category: IC; Mouser Description: Automotive 4-Channel ESD Protection Solution for SuperSpeed (up to 5 Gbps) Interface 10-USON -40 to 125; Temperature: -40°C to +125°C; ComponentLink2URL: http://www.ti.com/lit/ds/symlink/tpd4e05u06-q1.pdf; Digikey Description: TVS DIODE 5.5V 14V 10USON; Lead Free: Yes
TP6 TP7 = S2761-46R: Supplier 1: DigiKey; Supplier Part Number 1: 952-2665-1-ND
U4 = MP4247GQV-0000-Z: Supplier 1: Future Electronics; Supplier Part Number 1: 3182743
U5 = MP5031GRE-00A3-Z: Supplier 1: DigiKey; Supplier Part Number 1: 1589-MP5031GRE-00A3-ZCT-ND